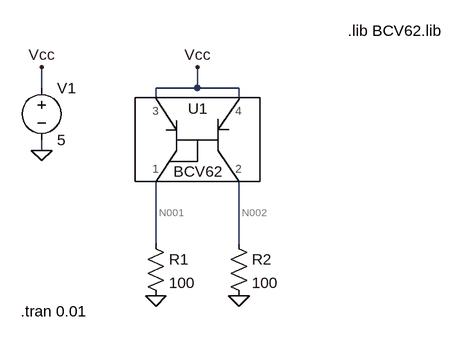
[diagram p0: schematic Fuente.asc]
Fuente.asc, the LTspice schematic file:
Version 4
SHEET 1 1060 680
WIRE 432 -224 432 -256
WIRE 672 -224 672 -256
WIRE 672 -224 608 -224
WIRE 736 -224 672 -224
WIRE 608 -208 608 -224
WIRE 736 -208 736 -224
WIRE 432 -128 432 -144
WIRE 608 16 608 -80
WIRE 736 16 736 -80
FLAG 432 -128 0
FLAG 432 -256 Vcc
FLAG 672 -256 Vcc
FLAG 608 96 0
FLAG 736 96 0
SYMBOL BCV62 672 -144 R0
SYMATTR InstName U1
SYMBOL res 592 0 R0
SYMATTR InstName R1
SYMATTR Value 100
SYMBOL res 720 0 R0
SYMATTR InstName R2
SYMATTR Value 100
SYMBOL voltage 432 -240 R0
WINDOW 123 0 0 Left 2
WINDOW 39 0 0 Left 2
SYMATTR InstName V1
SYMATTR Value 5
TEXT 904 -312 Left 2 !.lib BCV62.lib
TEXT 400 120 Left 2 !.tran 0.01

The netlist it stands for:
* Fuente.asc
XU1 N001 N002 Vcc Vcc BCV62  ; pins 1 2 3 4
R1 N001 0 100
R2 N002 0 100
V1 Vcc 0 5
.lib BCV62.lib
.tran 0.01
.backanno
.end

* Results of the author's LTspice run, read from the files saved beside the schematic
* Operating Point, zero values left out:
*   V(n001) = 4.204 V
*   V(n002) = 4.244 V
*   V(vcc) = 5 V
*   I(R2) = 42.44 mA
*   I(R1) = 42.04 mA
*   I(V1) = -84.49 mA
*   Ix(u1:1) = -42.04 mA
*   Ix(u1:2) = -42.44 mA
*   Ix(u1:3) = 42.29 mA
*   Ix(u1:4) = 42.19 mA